# Altium schematic sheet ClosedLoop_Drive_MC_MicroSD_Card.SchDoc
size A4; SheetNumber: 5; SheetTotal: 8
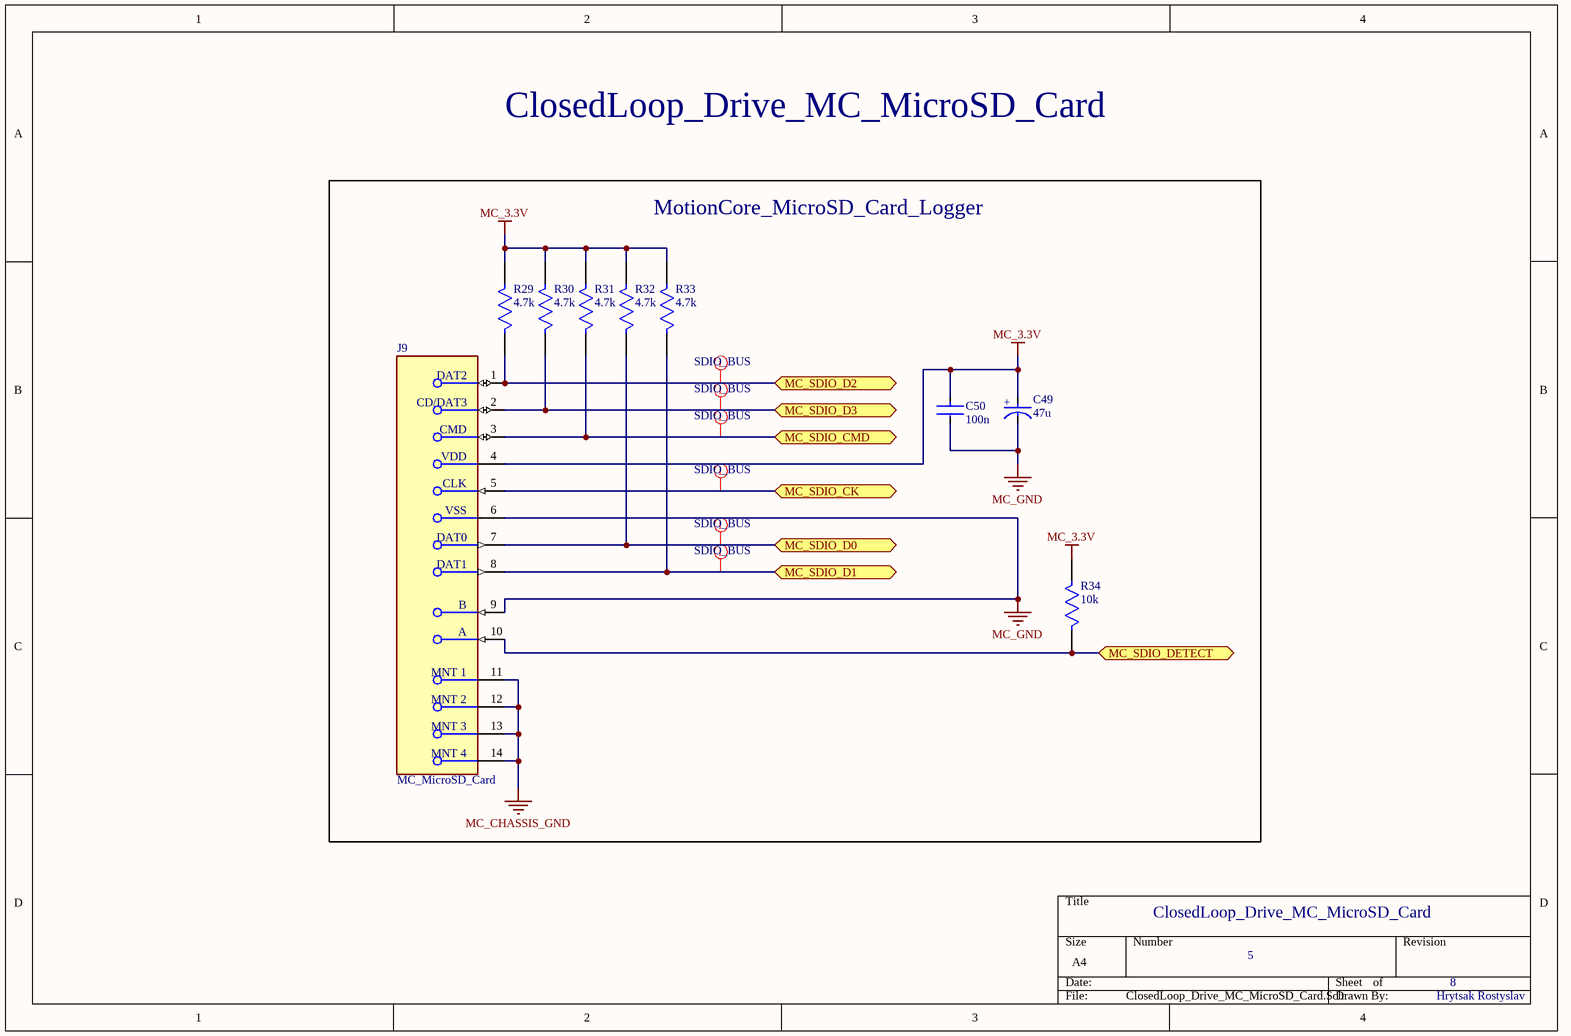
[diagram p0: ClosedLoop_Drive_MC_MicroSD_Card.SchDoc]

## Parts
C49  47u  [FP-RAD-TH-D_6_3_0_5-L_11-MFG]
C50  100n  [FP-0805-L_2_01_0_2-W_1_25-MFG]
J9  MC_MicroSD_Card  [FP-DM3AT-SF-PEJM5_40-MFG]
R29  4.7k  [FP-MCU0805-IPC_A]
R30  4.7k  [FP-MCU0805-IPC_A]
R31  4.7k  [FP-MCU0805-IPC_A]
R32  4.7k  [FP-MCU0805-IPC_A]
R33  4.7k  [FP-MCU0805-IPC_A]
R34  10k  [FP-MCU0805-IPC_A]

## Blocks framed on the sheet
MotionCore_MicroSD_Card_Logger: C49 C50 J9 R29-R34

## Ports
MC_SDIO_CK (bidir, see ClosedLoop_Drive_MotionCore[1D]), MC_SDIO_CMD (bidir, see ClosedLoop_Drive_MotionCore[1C]), MC_SDIO_D0 (bidir, see ClosedLoop_Drive_MotionCore[3C]), MC_SDIO_D1 (bidir, see ClosedLoop_Drive_MotionCore[3C]), MC_SDIO_D2 (bidir, see ClosedLoop_Drive_MotionCore[3C]), MC_SDIO_D3 (bidir, see ClosedLoop_Drive_MotionCore[3C]), MC_SDIO_DETECT (bidir, see ClosedLoop_Drive_MotionCore[1C])

## Nets
MC_3.3V: C49.2(A) C50.1 J9.4(VDD) R29.2 R30.2 R31.2 R32.2 R33.2 R34.2
MC_CHASSIS_GND: J9.11(MNT_1) J9.12(MNT_2) J9.13(MNT_3) J9.14(MNT_4)
MC_GND: C49.1(C) C50.2 J9.6(VSS) J9.9(B)
MC_SDIO_CK: J9.5(CLK) ; port MC_SDIO_CK
MC_SDIO_CMD: J9.3(CMD) R31.1 ; port MC_SDIO_CMD
MC_SDIO_D0: J9.7(DAT0) R32.1 ; port MC_SDIO_D0
MC_SDIO_D1: J9.8(DAT1) R33.1 ; port MC_SDIO_D1
MC_SDIO_D2: J9.1(DAT2) R29.1 ; port MC_SDIO_D2
MC_SDIO_D3: J9.2(CD/DAT3) R30.1 ; port MC_SDIO_D3
MC_SDIO_DETECT: J9.10(A) R34.1 ; port MC_SDIO_DETECT

## Layout directives
net class SDIO_BUS: MC_SDIO_CK, MC_SDIO_CMD, MC_SDIO_D0, MC_SDIO_D1, MC_SDIO_D2, MC_SDIO_D3

## Notes on the sheet
- ClosedLoop_Drive_MC_MicroSD_Card
- 5
- 8
- Hrytsak Rostyslav
- (in symbol CMP-05427-000141-1) +

## Library data of the parts
C49 = CMP-05427-000141-1: Aluminum Electrolytic Capacitors (Radial Lead Type) AEC-Q200 Qualified 100uF ±20% 25V; Lead Diameter: 0.5mm; Life (Hours): 1000Hour; Ripple Current: 130mA; Lead/Base Style: Straight; Construction: RADIAL; Radiation Hardening: No; Packaging: Ammo Pack; Termination: Radial; Mount: Through Hole; Lead Pitch: 2.5mm; Tolerance: 20%; Height - Seated (Max): 0.48inch; Height: 11.2mm; Max Operating Temperature: 105°C; Length: 11.2mm; Diameter: 6.3mm; RoHS Compliant: Yes; Voltage Rating: 25V; Min Operating Temperature: -55°C; Package Quantity: 2000; Capacitance: 100uF; Width: 6.3mm; Voltage Rating (DC): 25V; Series: NHG; Contact Plating: Tin; Case/Package: Radial
C50 = CMP-07738-122049624-1: 0805; Tolerance: 10%; Dielectric: X7R; Material: Ceramic; Voltage Rating (DC): 100V; Capacitance: 1µF; Case/Package: 0805; Height: 1.4mm; Voltage Rating: 100V; Schedule B: 8532240020; NexarPartId: 122049624; RoHS: Compliant; Lifecycle Status: Production; Min Operating Temperature: -55°C; Max Operating Temperature: 125°C
J9 = CMP-11597-000006-1: CONN MICRO SD R/A PUSH-PUSH SMD; Contact Resistance: 100mR; Insulation Resistance: 1GR; Gender: Receptacle; Max Voltage Rating (AC): 125V; Pitch: 1.1mm; Mating Cycles: 10000; Max Current Rating: 500mA; Connector Type: Connector; Number of Contacts: 8; Housing Material: Polymer; Flammability Rating: UL94 V-0; REACH SVHC: No SVHC; Lead Free: Lead Free; Package Quantity: 400; Length: 13.85mm; Number of Rows: 2; Series: DM3; Min Operating Temperature: -25°C; Voltage Rating (AC): 125V; Contact Material: Copper Alloy; Depth: 15.95mm; Contact Plating: Gold; Packaging: Tape and Reel; Width: 13.85mm; Orientation: Right Angle; Color: Black; Voltage Rating: 125V; Radiation Hardening: No; Termination: Solder; Current Rating: 500mA; Mount: Surface Mount; Max Operating Temperature: 85°C
R29-R34 = CMP-02407-001153-1: 0805; Power Rating: 200mW; Temperature Coefficient: 25ppm/°C; Voltage Rating: 150V; Resistance: 4.99kR; Tolerance: 0.5%; Case Code (Imperial): 0805; Features: Automotive AEC-Q200; Case Code (Metric): 2012; Weight: 0.000162oz; Width: 0.049inch; Packaging: Tape and Reel; Composition: Thin Film; Height: 0.024inch; Termination: SMD/SMT; Number of Terminations: 2; Min Operating Temperature: -55°C; Length: 0.079inch; Package Quantity: 5000; Max Operating Temperature: 175°C; Case/Package: 0805; Max Power Dissipation: 200mW